# EAGLE design AVR_USB_IR_RC6 (EAGLE 4.16)
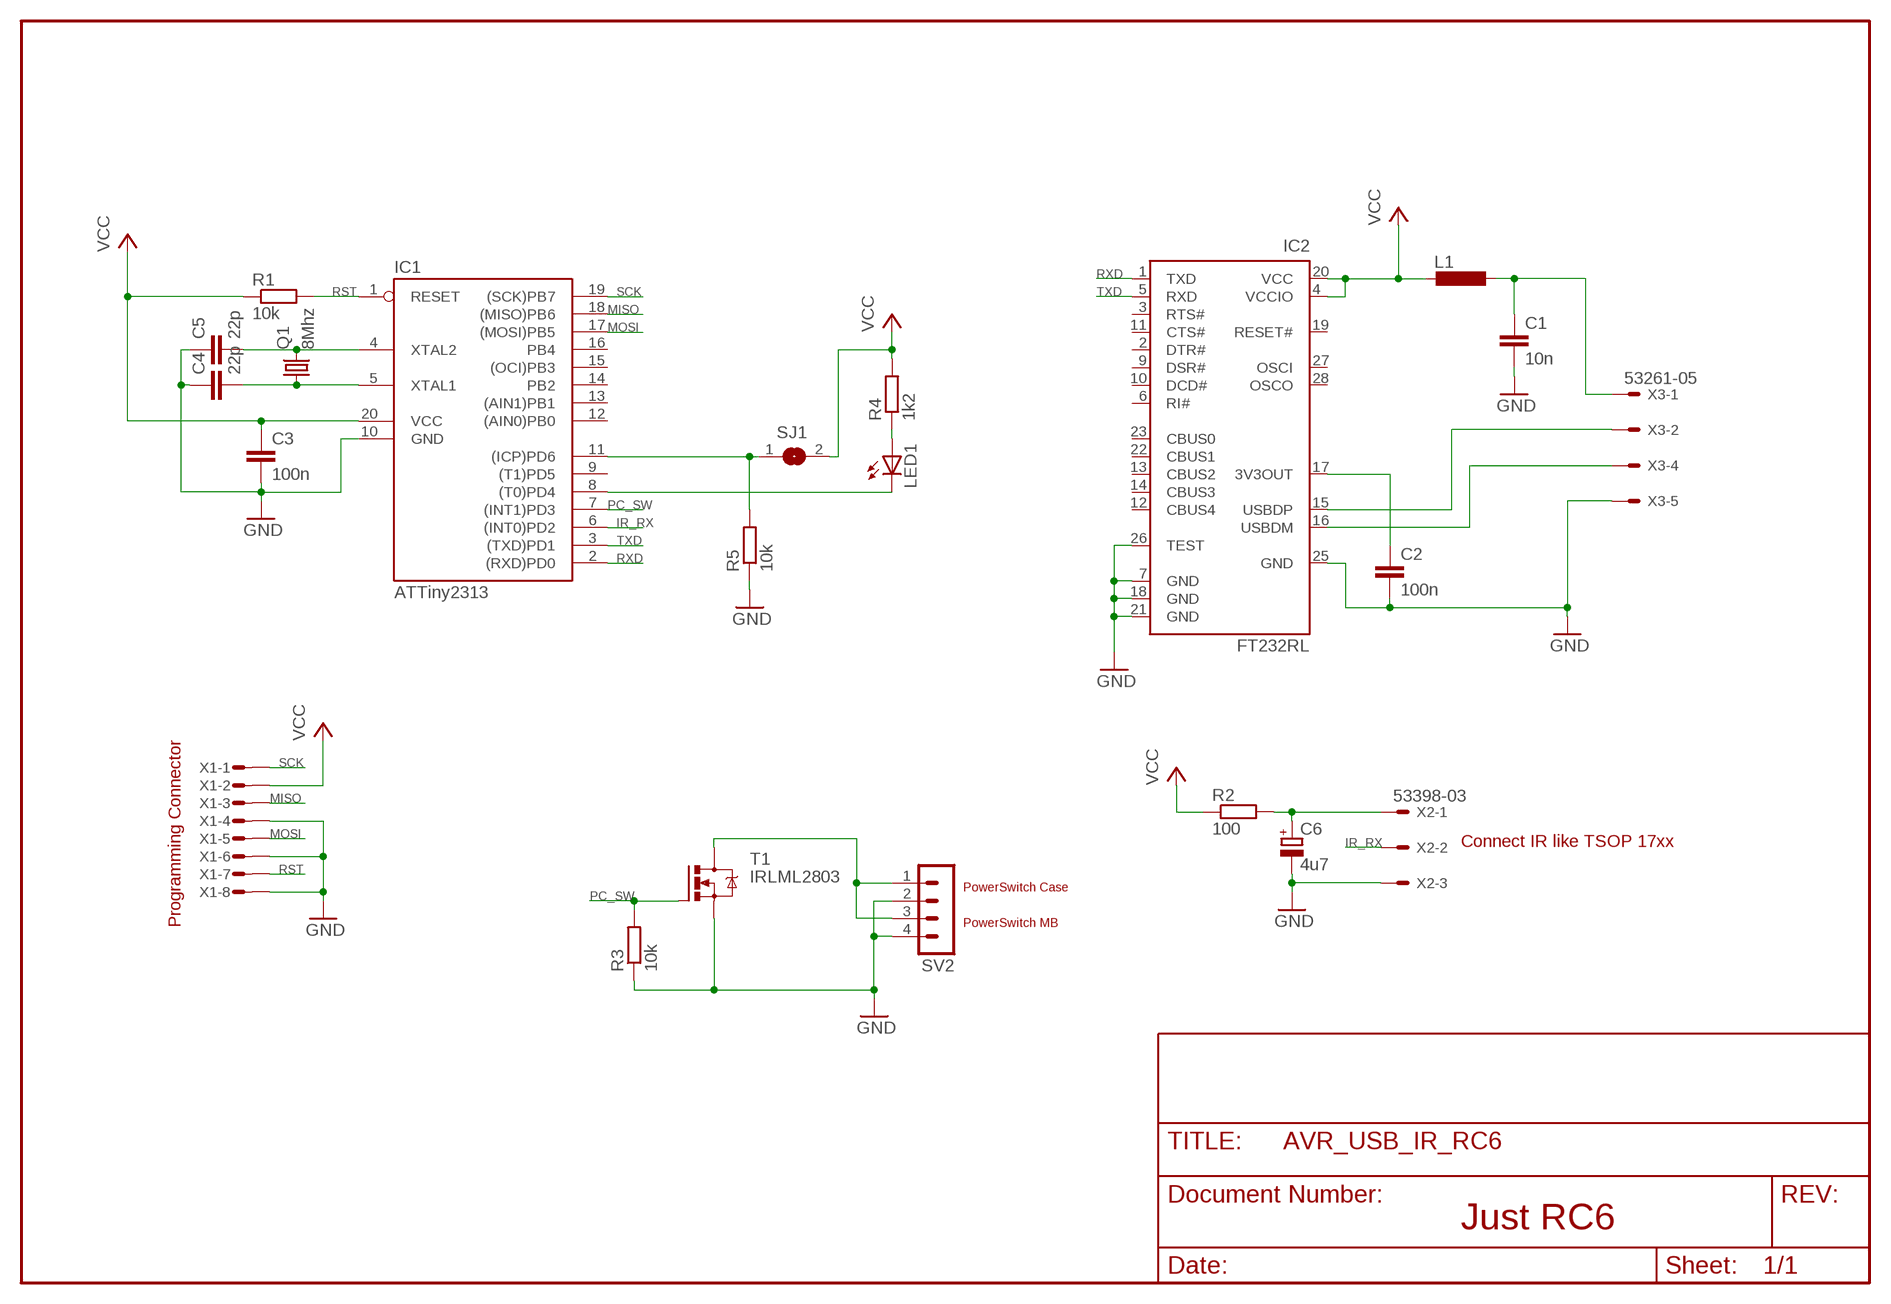
[diagram p0: schematic, sheet 1]

## Parts
C1  10n  C-EUC0805  [C0805]
C2  100n  C-EUC0805  [C0805]
C3  100n  C-EUC0805  [C0805]
C4  22p  C-EUC0805  [C0805]
C5  22p  C-EUC0805  [C0805]
C6  4u7  CPOL-EUB  [PANASONIC_B]
IC1  ATTiny2313  AT90S2313S  [SO20W]
IC2  FT232RL  [SSOP28]
L1  L-EUL2012C  [L2012C]
LED1  LEDCHIPLED_1206  [CHIPLED_1206]
Q1  8Mhz  CRYSTALHC49UP  [HC49UP]
R1  10k  R-EU_M0805  [M0805]
R2  100  R-EU_M0805  [M0805]
R3  10k  R-EU_M0805  [M0805]
R4  1k2  R-EU_M0805  [M0805]
R5  10k  R-EU_M0805  [M0805]
SJ1  SJ  [SJ]
SV2  MA04-1  [MA04-1]
T1  IRLML2803  [MICRO3]
X1  MICROMATCH-8  [MICROMATCH-8]
X2  53398-03  [53398-03]
X3  53261-05  [53261-05]

## Nets
GND: C1.2 C2.2 C3.2 C4.1 C5.1 C6.- IC1.10(GND) IC2.7(GND) IC2.18(GND) IC2.21(GND) IC2.25(GND) IC2.26(TEST) R3.1 R5.1 SV2.2 SV2.4 T1.2(S) X1.4 X1.6 X1.8 X2.3 X3.5
IR_RX: IC1.6((INT0)PD2) X2.2
MISO: IC1.18((MISO)PB6) X1.3
MOSI: IC1.17((MOSI)PB5) X1.5
N$1: IC2.15(USBDP) X3.2
N$2: IC2.16(USBDM) X3.4
N$3: C2.1 IC2.17(3V3OUT)
N$4: C5.2 IC1.4(XTAL2) Q1.2
N$5: C1.1 L1.1 X3.1
N$6: C4.2 IC1.5(XTAL1) Q1.1
N$7: IC1.8((T0)PD4) LED1.C
N$9: LED1.A R4.1
N$10: IC1.11((ICP)PD6) R5.2 SJ1.1
N$11: C6.+ R2.2 X2.1
N$18: SV2.1 SV2.3 T1.3(D)
PC_SW: IC1.7((INT1)PD3) R3.2 T1.1(G)
RST: IC1.1(RESET) R1.2 X1.7
RXD: IC1.2((RXD)PD0) IC2.1(TXD)
SCK: IC1.19((SCK)PB7) X1.1
TXD: IC1.3((TXD)PD1) IC2.5(RXD)
VCC: C3.1 IC1.20(VCC) IC2.4(VCCIO) IC2.20(VCC) L1.2 R1.1 R2.1 R4.2 SJ1.2 X1.2
Unconnected: IC1.9((T1)PD5) IC1.12((AIN0)PB0) IC1.13((AIN1)PB1) IC1.14(PB2) IC1.15((OCI)PB3) IC1.16(PB4) IC2.2(DTR#) IC2.3(RTS#) IC2.6(RI#) IC2.9(DSR#) IC2.10(DCD#) IC2.11(CTS#) IC2.12(CBUS4) IC2.13(CBUS2) IC2.14(CBUS3) IC2.19(RESET#) IC2.22(CBUS1) IC2.23(CBUS0) IC2.27(OSCI) IC2.28(OSCO) X3.3

## Notes on the sheet
- Connect IR like TSOP 17xx
- PowerSwitch Case
- Programming Connector | PowerSwitch MB
- Just RC6

## Library data of the parts
C1-C5 = rcl:C-EU: CAPACITOR, European symbol
C6 = rcl:CPOL-EU: POLARIZED CAPACITOR, European symbol
IC1 = atmel1:AT90S2313: MICROCONTROLLER 2 Kbytes FLASH 128 bytes SRAM 128 bytes EEPROM UART
IC2 = ftdichip:FT232R: Source: http://www.ftdichip.com/Documents/DataSheets/DS_FT232R_v104.pdf
L1 = rcl:L-EU: INDUCTOR, European symbol
LED1 = led:LED: LED OSRAM: - CHIPLED LG R971, LG N971, LY N971, LG Q971, LY Q971, LO R971, LY R971 LH N974, LH R974 LS Q976, LO Q976, LY Q976 LO Q996 - Hyper CHIPLED LW Q18S LB Q993, LB Q99A, LB R99A - SideLED LS A670, LO A670, LY A670, LG A670, LP A670 LB A673, LV A673, LT A673, LW A673 LH A674 LY A675 LS A676, LA A676, LO A676, LY A676, LW A676 LS A679, LY A679, LG A679 - Hyper Micro SIDELED® LS Y876, LA Y876, LO Y876, LY Y876 LT Y87S - SmartLED LW L88C, LW L88S LB L89C, LB L89S, LG L890 LS L89K, LO L89K, LY L89K LS L896, LA L896, LO L896, LY L896 - TOPLED LS T670, LO T670, LY T670, LG T670, LP T670 LSG T670, LSP T670, LSY T670, LOP T670, LYG T670 LG T671, LOG T671, LSG T671 LB T673, LV T673, LT T673, LW T673 LH T674 LS T676, LA T676, LO T676, LY T676, LB T676, LH T676, LSB T676, LW T676 LB T67C, LV T67C, LT T67C, LS T67K, LO T67K, LY T67K, LW E67C LS E67B, LA E67B, LO E67B, LY E67B, LB E67C, LV E67C, LT E67C LW T67C LS T679, LY T679, LG T679 LS T770, LO T770, LY T770, LG T770, LP T770 LB T773, LV T773, LT T773, LW T773 LH T774 LS E675, LA E675, LY E675, LS T675 LS T776, LA T776, LO T776, LY T776, LB T776 LHGB T686 LT T68C, LB T68C - Hyper Mini TOPLED® LB M676 - Mini TOPLED Santana® LG M470 LS M47K, LO M47K, LY M47K Source: http://www.osram.convergy.de - LUMILED® LXK2-PW12-R00, LXK2-PW12-S00, LXK2-PW14-U00, LXK2-PW14-V00 LXK2-PM12-R00, LXK2-PM12-S00, LXK2-PM14-U00 LXK2-PE12-Q00, LXK2-PE12-R00, LXK2-PE12-S00, LXK2-PE14-T00, LXK2-PE14-U00 LXK2-PB12-K00, LXK2-PB12-L00, LXK2-PB12-M00, LXK2-PB14-N00, LXK2-PB14-P00, LXK2-PB14-Q00 LXK2-PR12-L00, LXK2-PR12-M00, LXK2-PR14-Q00, LXK2-PR14-R00 LXK2-PD12-Q00, LXK2-PD12-R00, LXK2-PD12-S00 LXK2-PH12-R00, LXK2-PH12-S00 LXK2-PL12-P00, LXK2-PL12-Q00, LXK2-PL12-R00 Source: www.luxeon.com
Q1 = crystal:CRYSTAL: CRYSTAL
R1-R5 = rcl:R-EU_: RESISTOR, European symbol
SJ1 = jumper:SJ: SMD solder JUMPER
SV2 = con-lstb:MA04-1: PIN HEADER
T1 = transistor-power1:IRLML2803
X1 = con-amp-micromatch:MICROMATCH-8: MicroMaTch 8 7-215464-8 / 0-215464-8 Drawing Number C-215464 DDEController.pdf
X2 = con-molex:53?-03: CONNECTOR wire to board 1.25 mm (.049 inch) pitch header
X3 = con-molex:53?-05: CONNECTOR wire to board 1.25 mm (.049 inch) pitch header

## Board
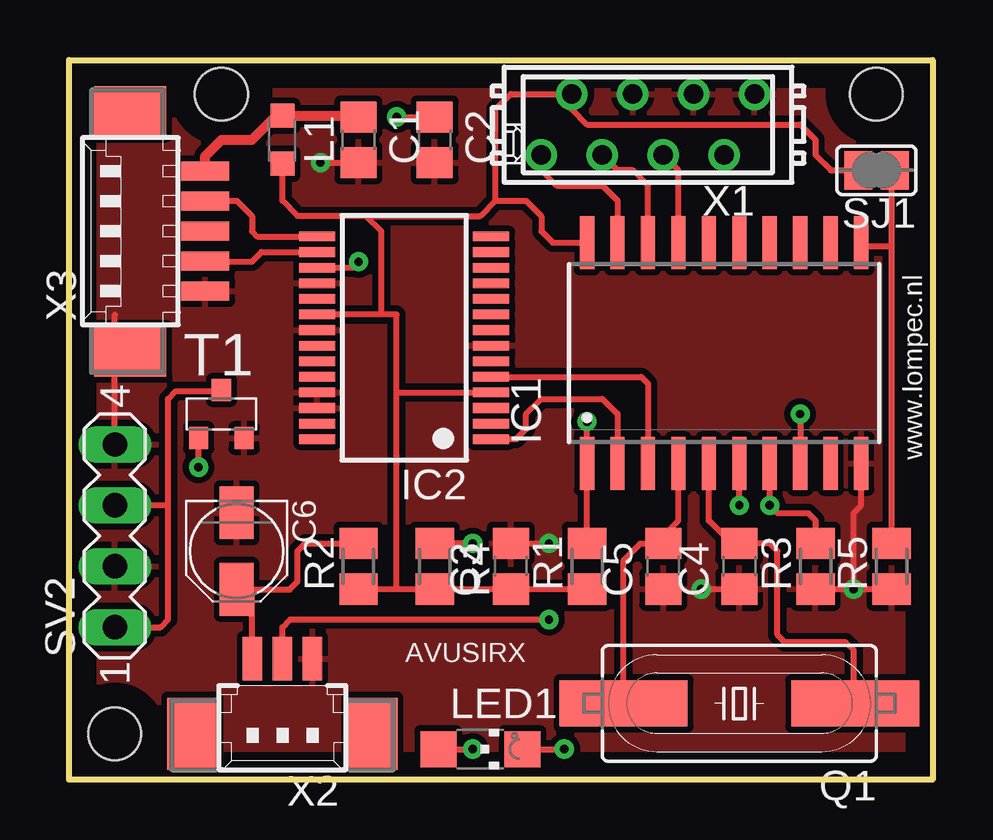
[diagram p1: board, top side]
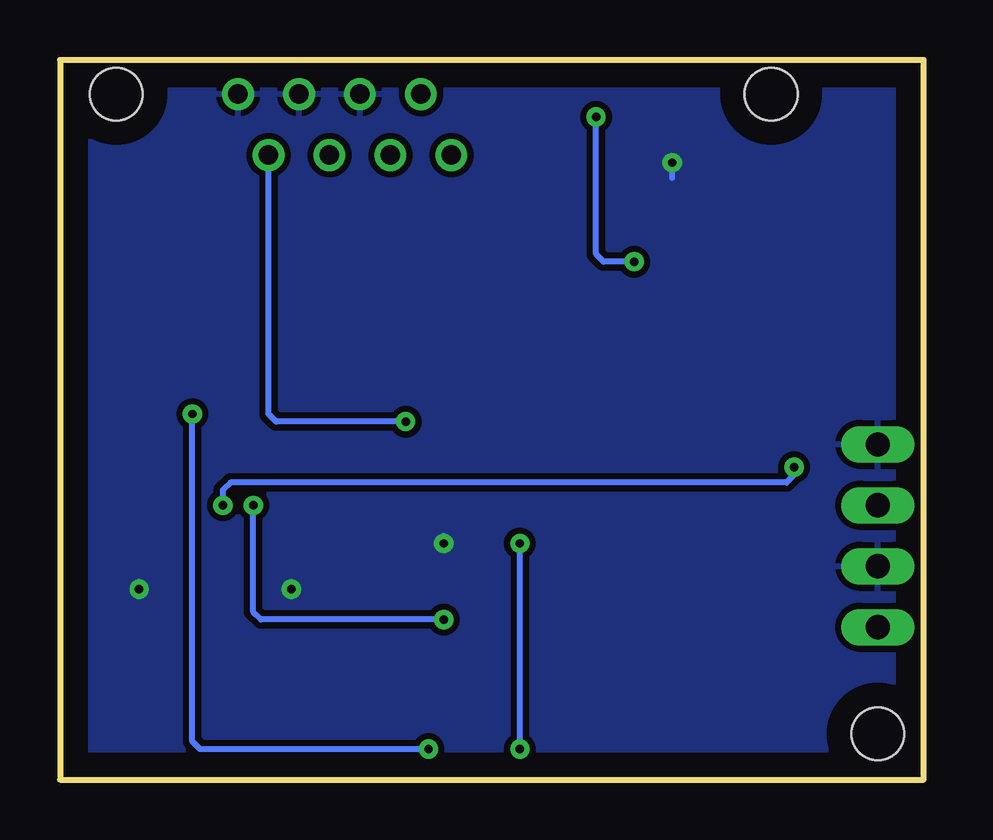
[diagram p2: board, bottom side, seen from below]

Size 36 x 30 mm. Coordinates in mm from the lower left corner, seen from the top.
Outline: 0,0 0,30 36,30 36,0 0,0
Copper layers (1*16): Top 0.035mm / dielectric 1.5mm / Bottom 0.035mm
Design rules "default": minimum track width 10mil, minimum drill 24mil, track to track 8mil, track to pad 8mil, pad to pad 8mil, via to via 8mil, smd to smd 8mil, copper to edge 40mil, drill to drill 8mil, minimum pad ring 10mil, minimum via ring 8mil, stop-mask expansion 4mil, vias tented up to drill 0mil, thermal gap 10mil
Holes 2.2 mm at 1.91,1.91 33.66,28.57 6.35,28.57

### Footprints (pad centres in the part's own frame; a part is rotated, then mirrored left to right if it is on the bottom)
C0805 = smd 1.3 x 1.5: 1 -0.95,0; 2 0.95,0
PANASONIC_B = smd 2.2 x 1.4: + 1.6,0; - -1.6,0
SO20W = smd 0.6 x 2.2: 1 -5.715,-4.6; 2 -4.445,-4.6; 3 -3.175,-4.6; 4 -1.905,-4.6; 5 -0.635,-4.6; 6 0.635,-4.6; 7 1.905,-4.6; 8 3.175,-4.6; 9 4.445,-4.6; 10 5.715,-4.6; 11 5.715,4.6; 12 4.445,4.6; 13 3.175,4.6; 14 1.905,4.6; 15 0.635,4.6; 16 -0.635,4.6; 17 -1.905,4.6; 18 -3.175,4.6; 19 -4.445,4.6; 20 -5.715,4.6
SSOP28 = smd 0.4 x 1.5: 1 -4.225,-3.625; 2 -3.575,-3.625; 3 -2.925,-3.625; 4 -2.275,-3.625; 5 -1.625,-3.625; 6 -0.975,-3.625; 7 -0.325,-3.625; 8 0.325,-3.625; 9 0.975,-3.625; 10 1.625,-3.625; 11 2.275,-3.625; 12 2.925,-3.625; 13 3.575,-3.625; 14 4.225,-3.625; 15 4.225,3.625; 16 3.575,3.625; 17 2.925,3.625; 18 2.275,3.625; 19 1.625,3.625; 20 0.975,3.625; 21 0.325,3.625; 22 -0.325,3.625; 23 -0.975,3.625; 24 -1.625,3.625; 25 -2.275,3.625; 26 -2.925,3.625; 27 -3.575,3.625; 28 -4.225,3.625
L2012C = smd 1 x 1: 1 -1,0; 2 1,0
CHIPLED_1206 = smd 1.5 x 1.5: A 0,-1.75; C 0,1.75
HC49UP = smd 5.334 x 1.93: 1 -4.826,0; 2 4.826,0
M0805 = smd 1.3 x 1.6: 1 -0.95,0; 2 0.95,0
SJ = smd 1.168 x 1.6: 1 -0.762,0; 2 0.762,0
MA04-1 = drill 1.016 long: 1 -3.81,0; 2 -1.27,0; 3 1.27,0; 4 3.81,0
MICRO3 = smd 0.8 x 0.9: 1 -0.95,-1; 2 0.95,-1; 3 0,1
MICROMATCH-8 = drill 0.813 round: 1 4.445,1.27; 2 3.175,-1.27; 3 1.905,1.27; 4 0.635,-1.27; 5 -0.635,1.27; 6 -1.905,-1.27; 7 -3.175,1.27; 8 -4.445,-1.27
53398-03 = smd 0.8 x 1.8: 1 1.25,-2.5; 2 0,-2.5; 3 -1.25,-2.5 | smd 2.1 x 3: S1 3.75,0.625; S2 -3.75,0.625
53261-05 = smd 0.8 x 2: 1 2.5,-2.5; 2 1.25,-2.5; 3 0,-2.5; 4 -1.25,-2.5; 5 -2.5,-2.5 | smd 2.1 x 3: S1 5,0.625; S2 -5,0.625

### Placement (x,y rotation side)
C1  12.06,26.67 270 top
C2  15.24,26.67 270 top
C3  18.41,8.89 90 top
C4  27.94,8.89 90 top
C5  24.77,8.89 90 top
C6  6.99,9.53 270 top
IC1  27.3,17.78 0 top
IC2  13.97,18.41 90 top
L1  8.89,26.67 270 top
LED1  17.14,1.27 270 top
Q1  27.94,3.17 180 top
R1  21.59,8.89 90 top
R2  12.06,8.89 90 top
R3  31.11,8.89 90 top
R4  15.24,8.89 270 top
R5  34.29,8.89 90 top
SJ1  33.66,25.4 180 top
SV2  1.91,10.16 90 top
T1  6.35,15.24 0 top
X1  24.13,27.3 180 top
X2  8.89,2.54 180 top
X3  3.17,22.86 90 top

### Tracks (layer width: path | path; a pad name or v marks a point on that pad's centre or on a via)
GND  (via drill 0.35 pad 0.8)
  Top 0.254: IC1.10 33.02,11.43 32.7,11.11 v32.7,7.94 | v32.7,7.94 R5.1 | v32.7,7.94 | R3.1 | R3.1 v32.7,7.94 | C4.1 v26.35,7.94 | R3.1 v32.7,7.94 | C3.2 v20,9.84 | SV2.4 1.91,19.37 | C1.2 v10.48,25.72
  Bottom 0.254: v32.7,7.94 32.7,8.26 | v26.35,7.94 26.35,8.26 | v20,9.84 20,10.16 | 10.48,25.08 v10.48,25.72
  pour Bottom (isolate 0.254): 0,29.84 35.88,29.84 35.88,0 0,0
  pour Top (isolate 0.254): 0,29.84 35.88,29.84 35.88,0 0,0
IR_RX  (via drill 0.35 pad 0.8)
  Top 0.254: X2.2 8.89,6.35 9.21,6.67 v20,6.67 | v27.94,11.43 IC1.6
  Bottom 0.254: v20,6.67 27.62,6.67 27.94,6.99 v27.94,11.43
MISO
  Top 0.254: IC1.18 24.13,24.77 23.5,25.4 22.86,25.4 X1.3
MOSI
  Top 0.254: IC1.17 25.4,25.4 X1.5
N$1
  Top 0.254: IC2.15 7.84,22.64 7.62,22.86 7.62,23.5 6.99,24.13 5.71,24.13 5.7,24.11 X3.2
N$2
  Top 0.254: IC2.16 8.02,21.99 7.62,21.59 5.71,21.59 5.7,21.61 X3.4
N$3  (via drill 0.35 pad 0.8)
  Top 0.254: IC2.17 11.81,21.34 v12.06,21.59 | C2.1 v13.65,27.62
  Bottom 0.254: v12.06,21.59 13.34,21.59 13.65,21.91 v13.65,27.62
N$4
  Top 0.254: IC1.4 25.4,10.79 24.77,10.16 C5.2 23.81,9.84 23.11,9.14 Q1.2
N$5
  Top 0.406: X3.1 5.67,26 6.35,26.67 7.62,26.67 8.62,27.67 L1.1 11.79,27.67 12.06,27.94 C1.1
N$6
  Top 0.254: IC1.5 26.67,10.79 27.62,9.84 C4.2 29.21,9.84 29.53,9.53 29.53,6.03 29.84,5.71 32.38,5.71 32.7,5.4 32.7,3.17 | 32.7,3.17 32.38,3.17 | Q1.1 32.7,3.17
N$7  (via drill 0.35 pad 0.8)
  Top 0.254: v30.48,15.24 IC1.8 | 18.73,1.27 LED1.C v20.64,1.27
  Bottom 0.254: v30.48,15.24 30.48,1.59 30.16,1.27 v20.64,1.27
N$9  (via drill 0.35 pad 0.8)
  Top 0.254: LED1.A v16.83,1.27 | R4.1 v16.83,9.84
  Bottom 0.254: v16.83,1.27 v16.83,9.84
N$10
  Top 0.254: SJ1.1 34.29,25.4 34.29,22.23 | R5.2 34.29,22.23 | IC1.11 33.02,22.23 34.29,22.23
N$11
  Top 0.254: X2.1 7.64,5.06 7.62,5.08 7.62,7.62 7.32,7.92 C6.+ 9.2,7.92 9.53,8.26 9.53,9.53 9.84,9.84 R2.2
N$18
  Top 0.254: T1.3 6.35,16.19 4.45,16.19 4.13,15.88 4.13,11.43 | SV2.1 3.81,6.35 4.13,6.67 4.13,11.43 | 4.13,11.43 SV2.3
PC_SW  (via drill 0.35 pad 0.8)
  Top 0.254: R3.2 31.11,10.79 30.8,11.11 29.53,11.11 v29.21,11.43 IC1.7 | T1.1 5.4,14.29 v5.4,13.02
  Bottom 0.254: v29.21,11.43 29.21,12.06 28.89,12.38 5.71,12.38 5.4,12.7 v5.4,13.02
RST  (via drill 0.35 pad 0.8)
  Top 0.254: R1.2 21.59,13.02 | 21.59,13.02 IC1.1 | 21.59,13.02 v21.59,14.92
  Bottom 0.254: X1.7 27.3,15.24 26.99,14.92 v21.59,14.92
RXD
  Top 0.254: IC2.1 18.64,14.19 19.05,14.61 19.05,15.24 19.68,15.88 22.23,15.88 22.86,15.24 IC1.2
SCK
  Top 0.254: IC1.19 22.86,24.13 22.23,24.77 20.32,24.77 19.68,25.4 X1.1
TXD
  Top 0.254: IC2.5 23.85,16.79 24.13,16.51 IC1.3
VCC
  Top 0.254: 13.02,19.39 IC2.20 | 13.02,19.39 13.63,19.39 13.65,19.37 13.65,16.19 | L1.2 8.89,24.13 9.53,23.5 12.38,23.5 | 12.38,23.5 13.02,22.86 13.02,19.39 | 17.78,24.13 17.78,27.94 18.41,28.57 X1.2 20.95,27.94 21.59,27.3 30.48,27.3 31.11,26.67 31.11,26.04 31.75,25.4 SJ1.2 | 17.78,24.13 17.14,23.5 12.38,23.5 | IC1.20 20.16,22.38 19.68,22.86 19.68,23.5 19.05,24.13 17.78,24.13 | R1.1 C3.1 R4.2 13.65,7.94 | R2.1 13.65,7.94 | 13.65,7.94 | 13.65,7.94 13.65,16.19 | IC2.4 13.71,16.14 13.65,16.19

### Text on the board
tPlace: www.lompec.nl | AVUSIRX